# Altium project MainBoard.PrjPCB (part 2 of 2)

## Sheet Mainboard_User_Interface.SchDoc
size A4
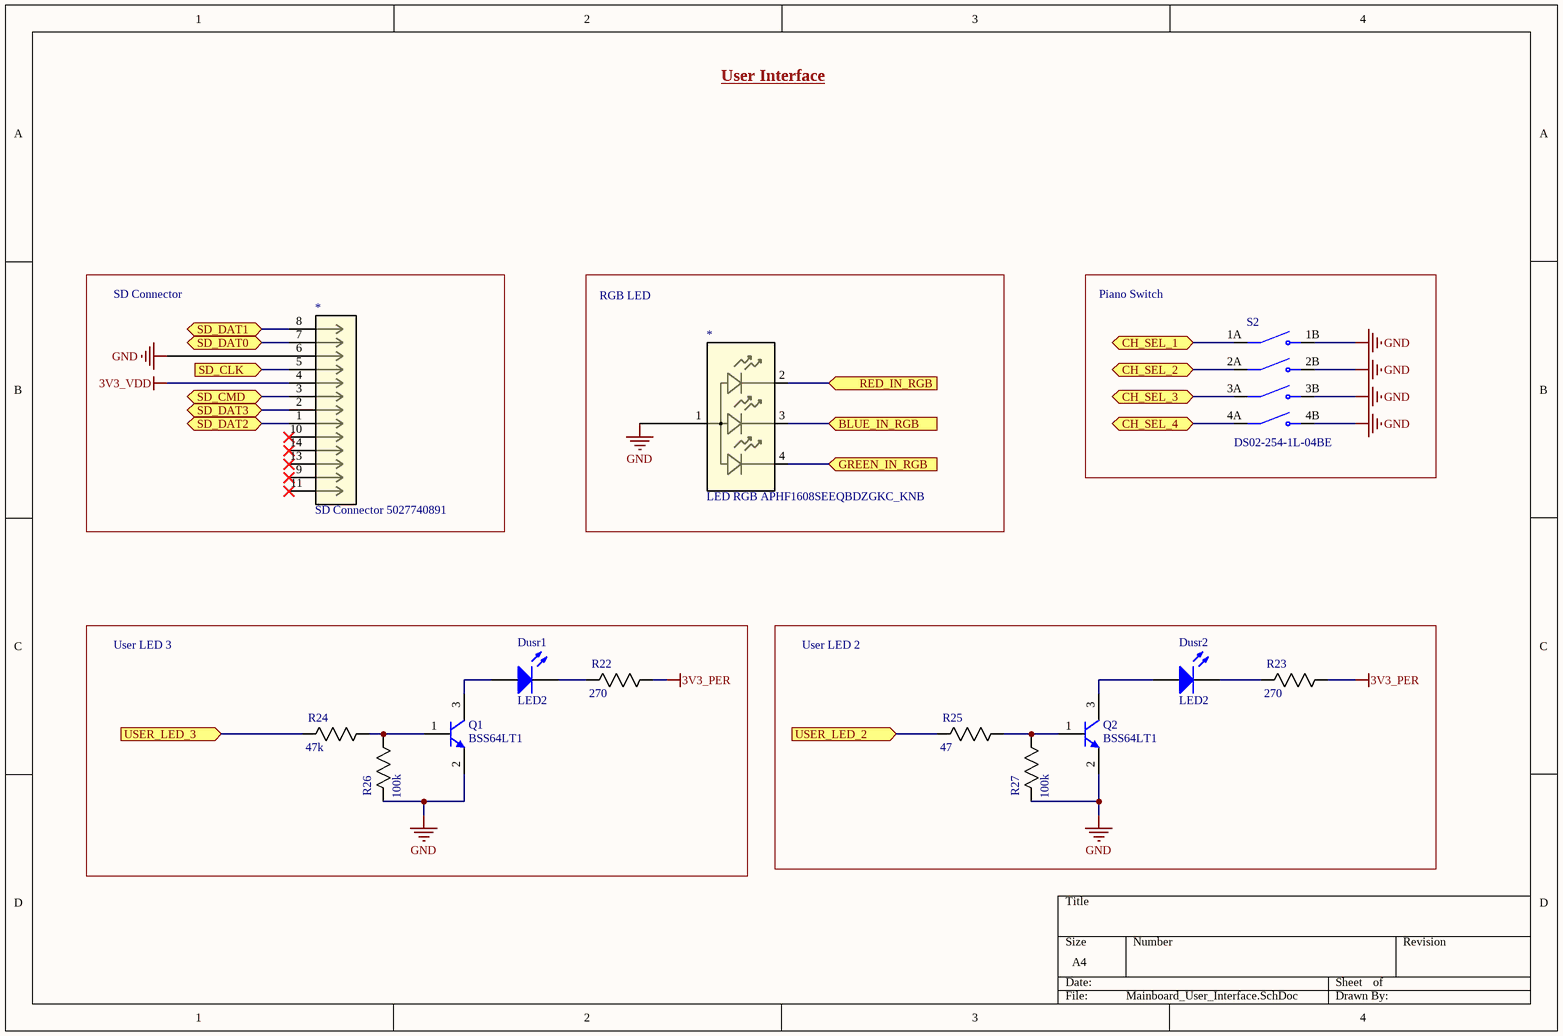
[diagram p10: Mainboard_User_Interface.SchDoc]

### Parts
(Parts that share a designator on the sheet are numbered #1, #2 ... from top to bottom, then left to right.)
*#1  LED RGB APHF1608SEEQBDZGKC_KNB  [LED RGB APHF1608SEEQBDZGKC_KNB-L]
*#2  SD Connector 5027740891  [SD Connector 5027740891]
Dusr1  LED2  [3.2X1.6X1.1]
Dusr2  LED2  [3.2X1.6X1.1]
Q1  BSS64LT1  [ONSC-SOT-23-3-318-08_V]
Q2  BSS64LT1  [ONSC-SOT-23-3-318-08_V]
R22  270  [0805]
R23  270  [0805]
R24  47k  [0805]
R25  47  [0805]
R26  100k  [0805]
R27  100k  [0805]
S2  DS02-254-1L-04BE  [SW_DS02-254-1L-04BE]

### Blocks framed on the sheet
SD Connector: *#2
RGB LED: *#1
Piano Switch: S2
User LED 3: Dusr1 Q1 R22 R24 R26
User LED 2: Dusr2 Q2 R23 R25 R27

### Ports
BLUE_IN_RGB (in), CH_SEL_1 (bidir), CH_SEL_2 (bidir), CH_SEL_3 (bidir), CH_SEL_4 (bidir), GREEN_IN_RGB (in), RED_IN_RGB (in), SD_CLK (in), SD_CMD (bidir), SD_DAT0 (bidir), SD_DAT1 (bidir), SD_DAT2 (bidir), SD_DAT3 (bidir), USER_LED_2 (in), USER_LED_3 (in)

### Nets
3V3_PER: R22.1(R1) R23.1(R1)
3V3_VDD: *#2.4
GND: *#1.1 *#2.6 Q1.2(E) Q2.2(E) R26.2(R2) R27.2(R2) S2.1B(NO1) S2.2B(NO2) S2.3B(NO3) S2.4B(NO4)
Net*#1_2: *#1.2 ; port RED_IN_RGB
Net*#1_3: *#1.3 ; port BLUE_IN_RGB
Net*#1_4: *#1.4 ; port GREEN_IN_RGB
Net*#2_1: *#2.1 ; port SD_DAT2
Net*#2_2: *#2.2 ; port SD_DAT3
Net*#2_3: *#2.3 ; port SD_CMD
Net*#2_5: *#2.5 ; port SD_CLK
Net*#2_7: *#2.7 ; port SD_DAT0
Net*#2_8: *#2.8 ; port SD_DAT1
NetDusr1_1: Dusr1.1(A) Q1.3(C)
NetDusr1_2: Dusr1.2(K) R22.2(R2)
NetDusr2_1: Dusr2.1(A) Q2.3(C)
NetDusr2_2: Dusr2.2(K) R23.2(R2)
NetQ1_1: Q1.1(B) R24.1(R1) R26.1(R1)
NetQ2_1: Q2.1(B) R25.1(R1) R27.1(R1)
NetR24_2: R24.2(R2) ; port USER_LED_3
NetR25_2: R25.2(R2) ; port USER_LED_2
NetS2_1A: S2.1A(COM1) ; port CH_SEL_1
NetS2_2A: S2.2A(COM2) ; port CH_SEL_2
NetS2_3A: S2.3A(COM3) ; port CH_SEL_3
NetS2_4A: S2.4A(COM4) ; port CH_SEL_4

Not connected (* = marked no-connect by the designer): *#2 9* 10* 11* 13* 14*

### Notes on the sheet
- User Interface

### Library data of the parts
Dusr1 = LED RED SMD: Typical RED, GREEN, YELLOW, AMBER GaAs LED; Lens Color: Colorless; Voltage - Forward (Vf) (Typ): 1.7V; Current - Test: 20mA; Lens Transparency: Clear; Package: 1206; Color: Red
Dusr2 = LED GREEN SMD: Typical RED, GREEN, YELLOW, AMBER GaAs LED; Voltage - Forward (Vf) (Typ): 2V; Lens Transparency: Clear; Current - Test: 20mA; Package: 1206; Color: Green
Q1 Q2 = CMP-1048-00605-1: Driver Transistor, NPN Silicon, 3-Pin SOT-23, Tape and Reel; Manufacturer: On Semiconductor; IC Continuous (A): 0.1; fT Min (MHz): 60; ComponentLink1Description: Manufacturer URL; ComponentLink3Description: Package Specification; ComponentLink2URL: http://www.onsemi.com/pub_link/Collateral/BSS64LT1-D.PDF; ComponentLink1URL: http://www.onsemi.com/; ComponentLink2Description: Datasheet; ComponentLink3URL: http://www.onsemi.cn/pub_link/Collateral/318-08.PDF; RoHS: FALSE; PackageVersion: Rev. AP, 11/2009; Polarity: NPN; PartNumber: BSS64LT1; Mounting Technology: Surface Mount; PackageDescription: 3-Pin Small Outline Transistor, Body 2.92 x 1.3 mm, Pitch 0.95 mm; Packing: Tape and Reel; DatasheetVersion: Rev. 5; PackageReference: SOT-23-3-318-08
R22 R23 = RES 270.0 1/8W: RES SMD 270 OHM 5% 1/8W 0805; Power (Watts): 0.125W; Package: 0805; Value: 270; Tolerance: 5%
R24 = RES 47k 1/8W - 1%: RES SMD 47K OHM 1% 1/8W 0805; Power (Watts): 0.125W; Package: 0805; Value: 47k; Tolerance: 1%
R25 = RES 47.0 1/8W - 1%: RES SMD 47 OHM 1% 1/8W 0805; Power (Watts): 0.125W; Package: 0805; Value: 47; Tolerance: 1%
R26 R27 = RES 100k 1/8W - 1%: RES SMD 100K OHM 1% 1/8W 0805; Power (Watts): 0.125W; Package: 0805; Value: 100k; Tolerance: 1%
S2 = DS02-254-1L-04BE: Dip Switch Piano Key 4-position; Package: None; Price: None; Value: *; MP: DS02-254-1L-04BE; Availability: Unavailable
*#1 = LED RGB APHF1608SEEQBDZGKC_KNB: ComponentLink1Description: Digikey; ComponentLink1URL: https://www.digikey.com/en/products/detail/kingbright/APHF1608SEEQBDZGKC/7597099
*#2 = SD Connector 5027740891: ComponentLink1Description: Digikey; ComponentLink1URL: https://www.digikey.ca/en/products/detail/molex/5027740891/1952536

## Sheet Mainboard_MCU_Breakout.SchDoc
size B
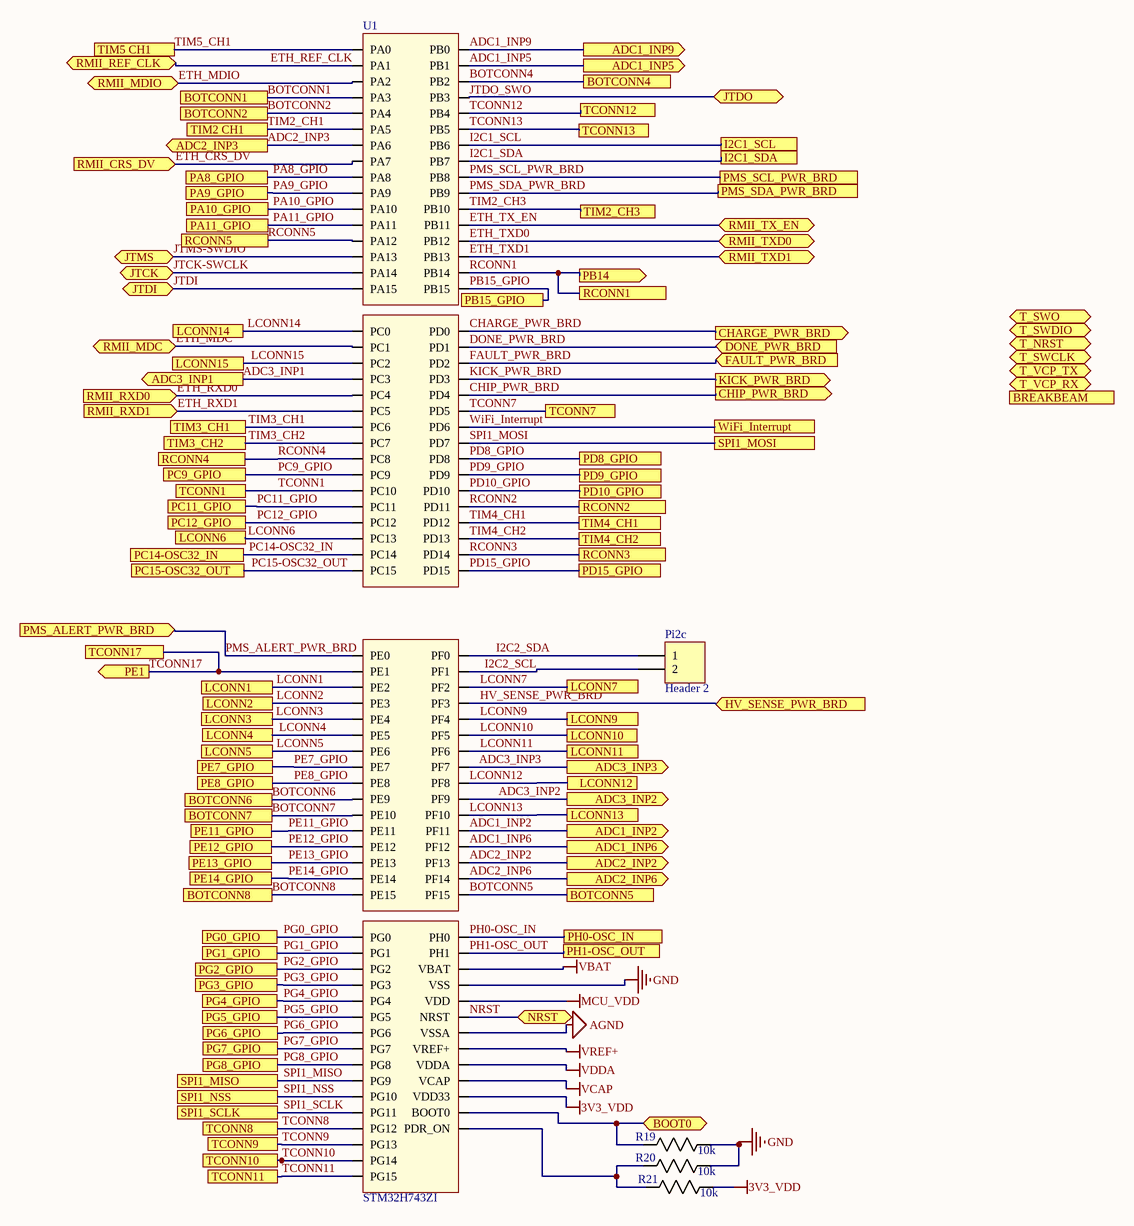
[diagram p11: Mainboard_MCU_Breakout.SchDoc]

### Parts
Pi2c  Header 2  [HDR1X2]
R19  10k  [0805]
R20  10k  [0805]
R21  10k  [0805]
U1  STM32H743ZI  [STM32H7]

### Ports
ADC1_INP2 (out), ADC1_INP5 (out), ADC1_INP6 (out), ADC1_INP9 (out), ADC2_INP2 (out), ADC2_INP3 (out), ADC2_INP6 (out), ADC3_INP1 (out), ADC3_INP2 (out), ADC3_INP3 (out), BOOT0 (bidir), BOTCONN1, BOTCONN2, BOTCONN4, BOTCONN5, BOTCONN6, BOTCONN7, BOTCONN8, BREAKBEAM (in), CHARGE_PWR_BRD (out), CHIP_PWR_BRD (out), DONE_PWR_BRD (in), FAULT_PWR_BRD (in), HV_SENSE_PWR_BRD (in), I2C1_SCL, I2C1_SDA, JTCK (bidir), JTDI (bidir), JTDO (bidir), JTMS (bidir), KICK_PWR_BRD (out), LCONN1, LCONN2, LCONN3, LCONN4, LCONN5, LCONN6, LCONN7, LCONN9, LCONN10, LCONN11, LCONN12, LCONN13, LCONN14, LCONN15, NRST (bidir), PA8_GPIO, PA9_GPIO, PA10_GPIO, PA11_GPIO, PB14 (out), PB15_GPIO, PC9_GPIO, PC11_GPIO, PC12_GPIO, PC14-OSC32_IN, PC15-OSC32_OUT, PD8_GPIO, PD9_GPIO, PD10_GPIO, PD15_GPIO, PE1 (out), PE7_GPIO, PE8_GPIO, PE11_GPIO, PE12_GPIO, PE13_GPIO, PE14_GPIO, PG0_GPIO, PG1_GPIO, PG2_GPIO, PG3_GPIO, PG4_GPIO, PG5_GPIO, PG6_GPIO, PG7_GPIO, PG8_GPIO, PH0-OSC_IN, PH1-OSC_OUT, PMS_ALERT_PWR_BRD (in), PMS_SCL_PWR_BRD, PMS_SDA_PWR_BRD, RCONN1, RCONN2, RCONN3, RCONN4, RCONN5, RMII_CRS_DV (in), RMII_MDC (bidir), RMII_MDIO (bidir), RMII_REF_CLK (bidir), RMII_RXD0 (in), RMII_RXD1 (in), RMII_TX_EN (bidir), RMII_TXD0 (bidir), RMII_TXD1 (bidir), SPI1_MISO, SPI1_MOSI, SPI1_NSS, SPI1_SCLK, T_NRST (bidir), T_SWCLK (bidir), T_SWDIO (bidir), T_SWO (bidir), T_VCP_RX (bidir), T_VCP_TX (bidir), TCONN1, TCONN7, TCONN8, TCONN9, TCONN10, TCONN11, TCONN12, TCONN13, TCONN17, TIM2 CH1, TIM2_CH3, TIM3_CH1, TIM3_CH2, TIM4_CH1, TIM4_CH2, TIM5 CH1, WiFi_Interrupt

### Nets
3V3_VDD: R21.1(R1) U1.VDD33USB(VDD33)
AGND: U1.VSSA
GND: R19.1(R1) R20.1(R1) U1.VSS
MCU_VDD: U1.VDD
VBAT: U1.VBAT
VCAP: U1.VCAP
VDDA: U1.VDDA
VREF+: U1.VREF+
ADC1_INP2: U1.PF11 ; port ADC1_INP2
ADC1_INP5: U1.PB1 ; port ADC1_INP5
ADC1_INP6: U1.PF12 ; port ADC1_INP6
ADC1_INP9: U1.PB0 ; port ADC1_INP9
ADC2_INP2: U1.PF13 ; port ADC2_INP2
ADC2_INP3: U1.PA6 ; port ADC2_INP3
ADC2_INP6: U1.PF14 ; port ADC2_INP6
ADC3_INP1: U1.PC3 ; port ADC3_INP1
ADC3_INP2: U1.PF9 ; port ADC3_INP2
ADC3_INP3: U1.PF7 ; port ADC3_INP3
BOTCONN1: U1.PA3 ; port BOTCONN1
BOTCONN2: U1.PA4 ; port BOTCONN2
BOTCONN4: U1.PB2 ; port BOTCONN4
BOTCONN5: U1.PF15 ; port BOTCONN5
BOTCONN6: U1.PE9 ; port BOTCONN6
BOTCONN7: U1.PE10 ; port BOTCONN7
BOTCONN8: U1.PE15 ; port BOTCONN8
CHARGE_PWR_BRD: U1.PD0 ; port CHARGE_PWR_BRD
CHIP_PWR_BRD: U1.PD4 ; port CHIP_PWR_BRD
DONE_PWR_BRD: U1.PD1 ; port DONE_PWR_BRD
ETH_CRS_DV: U1.PA7 ; port RMII_CRS_DV
ETH_MDC: U1.PC1 ; port RMII_MDC
ETH_MDIO: U1.PA2 ; port RMII_MDIO
ETH_REF_CLK: U1.PA1 ; port RMII_REF_CLK
ETH_RXD0: U1.PC4 ; port RMII_RXD0
ETH_RXD1: U1.PC5 ; port RMII_RXD1
ETH_TX_EN: U1.PB11 ; port RMII_TX_EN
ETH_TXD0: U1.PB12 ; port RMII_TXD0
ETH_TXD1: U1.PB13 ; port RMII_TXD1
FAULT_PWR_BRD: U1.PD2 ; port FAULT_PWR_BRD
HV_SENSE_PWR_BRD: U1.PF3 ; port HV_SENSE_PWR_BRD
I2C1_SCL: U1.PB6 ; port I2C1_SCL
I2C1_SDA: U1.PB7 ; port I2C1_SDA
I2C2_SCL: Pi2c.2 U1.PF1
I2C2_SDA: Pi2c.1 U1.PF0
JTCK-SWCLK: U1.PA14 ; port JTCK
JTDI: U1.PA15 ; port JTDI
JTDO_SWO: U1.PB3 ; port JTDO
JTMS-SWDIO: U1.PA13 ; port JTMS
KICK_PWR_BRD: U1.PD3 ; port KICK_PWR_BRD
LCONN1: U1.PE2 ; port LCONN1
LCONN2: U1.PE3 ; port LCONN2
LCONN3: U1.PE4 ; port LCONN3
LCONN4: U1.PE5 ; port LCONN4
LCONN5: U1.PE6 ; port LCONN5
LCONN6: U1.PC13 ; port LCONN6
LCONN7: U1.PF2 ; port LCONN7
LCONN9: U1.PF4 ; port LCONN9
LCONN10: U1.PF5 ; port LCONN10
LCONN11: U1.PF6 ; port LCONN11
LCONN12: U1.PF8 ; port LCONN12
LCONN13: U1.PF10 ; port LCONN13
LCONN14: U1.PC0 ; port LCONN14
LCONN15: U1.PC2 ; port LCONN15
NRST: U1.NRST ; port NRST
PA8_GPIO: U1.PA8 ; port PA8_GPIO
PA9_GPIO: U1.PA9 ; port PA9_GPIO
PA10_GPIO: U1.PA10 ; port PA10_GPIO
PA11_GPIO: U1.PA11 ; port PA11_GPIO
PB15_GPIO: U1.PB15 ; port PB15_GPIO
PC9_GPIO: U1.PC9 ; port PC9_GPIO
PC11_GPIO: U1.PC11 ; port PC11_GPIO
PC12_GPIO: U1.PC12 ; port PC12_GPIO
PC14-OSC32_IN: U1.PC14 ; port PC14-OSC32_IN
PC15-OSC32_OUT: U1.PC15 ; port PC15-OSC32_OUT
PD8_GPIO: U1.PD8 ; port PD8_GPIO
PD9_GPIO: U1.PD9 ; port PD9_GPIO
PD10_GPIO: U1.PD10 ; port PD10_GPIO
PD15_GPIO: U1.PD15 ; port PD15_GPIO
PE7_GPIO: U1.PE7 ; port PE7_GPIO
PE8_GPIO: U1.PE8 ; port PE8_GPIO
PE11_GPIO: U1.PE11 ; port PE11_GPIO
PE12_GPIO: U1.PE12 ; port PE12_GPIO
PE13_GPIO: U1.PE13 ; port PE13_GPIO
PE14_GPIO: U1.PE14 ; port PE14_GPIO
PG0_GPIO: U1.PG0 ; port PG0_GPIO
PG1_GPIO: U1.PG1 ; port PG1_GPIO
PG2_GPIO: U1.PG2 ; port PG2_GPIO
PG3_GPIO: U1.PG3 ; port PG3_GPIO
PG4_GPIO: U1.PG4 ; port PG4_GPIO
PG5_GPIO: U1.PG5 ; port PG5_GPIO
PG6_GPIO: U1.PG6 ; port PG6_GPIO
PG7_GPIO: U1.PG7 ; port PG7_GPIO
PG8_GPIO: U1.PG8 ; port PG8_GPIO
PH0-OSC_IN: U1.PH0 ; port PH0-OSC_IN
PH1-OSC_OUT: U1.PH1 ; port PH1-OSC_OUT
PMS_ALERT_PWR_BRD: U1.PE0 ; port PMS_ALERT_PWR_BRD
PMS_SCL_PWR_BRD: U1.PB8 ; port PMS_SCL_PWR_BRD
PMS_SDA_PWR_BRD: U1.PB9 ; port PMS_SDA_PWR_BRD
RCONN1: U1.PB14 ; port PB14, port RCONN1
RCONN2: U1.PD11 ; port RCONN2
RCONN3: U1.PD14 ; port RCONN3
RCONN4: U1.PC8 ; port RCONN4
RCONN5: U1.PA12 ; port RCONN5
SPI1_MISO: U1.PG9 ; port SPI1_MISO
SPI1_MOSI: U1.PD7 ; port SPI1_MOSI
SPI1_NSS: U1.PG10 ; port SPI1_NSS
SPI1_SCLK: U1.PG11 ; port SPI1_SCLK
TCONN1: U1.PC10 ; port TCONN1
TCONN7: U1.PD5 ; port TCONN7
TCONN8: U1.PG12 ; port TCONN8
TCONN9: U1.PG13 ; port TCONN9
TCONN10: U1.PG14 ; port TCONN10
TCONN11: U1.PG15 ; port TCONN11
TCONN12: U1.PB4 ; port TCONN12
TCONN13: U1.PB5 ; port TCONN13
TCONN17: U1.PE1 ; port PE1, port TCONN17
TIM2_CH1: U1.PA5 ; port TIM2 CH1
TIM2_CH3: U1.PB10 ; port TIM2_CH3
TIM3_CH1: U1.PC6 ; port TIM3_CH1
TIM3_CH2: U1.PC7 ; port TIM3_CH2
TIM4_CH1: U1.PD12 ; port TIM4_CH1
TIM4_CH2: U1.PD13 ; port TIM4_CH2
TIM5_CH1: U1.PA0 ; port TIM5 CH1
WiFi_Interrupt: U1.PD6 ; port WiFi_Interrupt
NetR19_2: R19.2(R2) U1.BOOT0 ; port BOOT0
NetR20_2: R20.2(R2) R21.2(R2) U1.PDR_ON

### Notes on the sheet
- (in symbol STM32H743ZIT6, part B) PB/PC
- (in symbol STM32H743ZIT6, part C) PD/PE
- (in symbol STM32H743ZIT6, part D) PF/PG

### Library data of the parts
Pi2c = Header 2: Header, 2-Pin; LatestRevisionDate: 17-Jul-2002; LatestRevisionNote: Re-released for DXP Platform.; Publisher: Altium Limited
R19-R21 = RES 10k 1/8W - 1%: RES SMD 10K OHM 1% 1/8W 0805; Power (Watts): 0.125W; Package: 0805; Value: 10k; Tolerance: 1%
U1 = STM32H743ZI: MF: STMicroelectronics; MP: STM32H743ZIT6; Digikey: 497-17721-ND; Digikey Link: https://www.digikey.ca/product-detail/en/stmicroelectronics/STM32H743ZIT6/497-17721-ND/7809238; Package: 144-LQFP (20x20)

## Nets that join several sheets
3V3: Mainboard_Encoder_Interface (13 pins), Mainboard_Motordriver_Interface (17 pins), Mainboard_RMII_Interface (8 pins), Mainboard_Wifi_Interface (Pwifi.7), MainBoard_MCU_Power (5 pins)
3V3_PER: MainBoard_MCU_Power (R15.1), Mainboard_User_Interface (R22.1 R23.1)
3V3_PWR_BRD: Mainboard_Power_Interface (J1.19 J1.20), MainBoard_MCU_Power (D8.A R28.2)
3V3_VDD: Mainboard_MCU_Func (U3#1.5 U3#1.8), MainBoard_MCU_Power (R10.2 R14.1), Mainboard_User_Interface (*#2.4), Mainboard_MCU_Breakout (R21.1 U1.VDD33USB)
5V: Mainboard_Motordriver_Interface (23 pins), Mainboard_Wifi_Interface (Pwifi.8), Mainboard_Breakbeam_Interface (J11.1), MainBoard_MCU_Power (D3.C D4.C)
5V_PWR_BRD: Mainboard_Power_Interface (J1.17 J1.18), MainBoard_MCU_Power (D4.A R17.2)
AGND: MainBoard_MCU_Power (5 pins), Mainboard_MCU_Breakout (U1.VSSA)
GND: Mainboard_Encoder_Interface (18 pins), Mainboard_MCU_Func (8 pins), Mainboard_Motordriver_Interface (70 pins), Mainboard_Power_Interface (8 pins), Mainboard_RMII_Interface (19 pins), Mainboard_Wifi_Interface (Pwifi.1), Mainboard_Breakbeam_Interface (J11.3), MainBoard_MCU_Power (28 pins), Mainboard_Debug_Interface (6 pins), Mainboard_User_Interface (10 pins), Mainboard_MCU_Breakout (R19.1 R20.1 U1.VSS)
MCU_VDD: MainBoard_MCU_Power (15 pins), Mainboard_MCU_Breakout (U1.VDD)
VBAT: MainBoard_MCU_Power (C21.2 R9.1), Mainboard_MCU_Breakout (U1.VBAT)
VCAP: MainBoard_MCU_Power (C8.2 C9.2), Mainboard_MCU_Breakout (U1.VCAP)
VCC: Mainboard_Motordriver_Interface (70 pins), Mainboard_Power_Interface (8 pins)
VDDA: MainBoard_MCU_Power (5 pins), Mainboard_MCU_Breakout (U1.VDDA)
VREF+: MainBoard_MCU_Power (R8.1), Mainboard_MCU_Breakout (U1.VREF+)
NetF1_1: MainBoard_MCU_Power (F1.1), Mainboard_Debug_Interface (U?.22)
NRST: Mainboard_MCU_Func (C30#1.2 S1.2), Mainboard_RMII_Interface (U9.15)